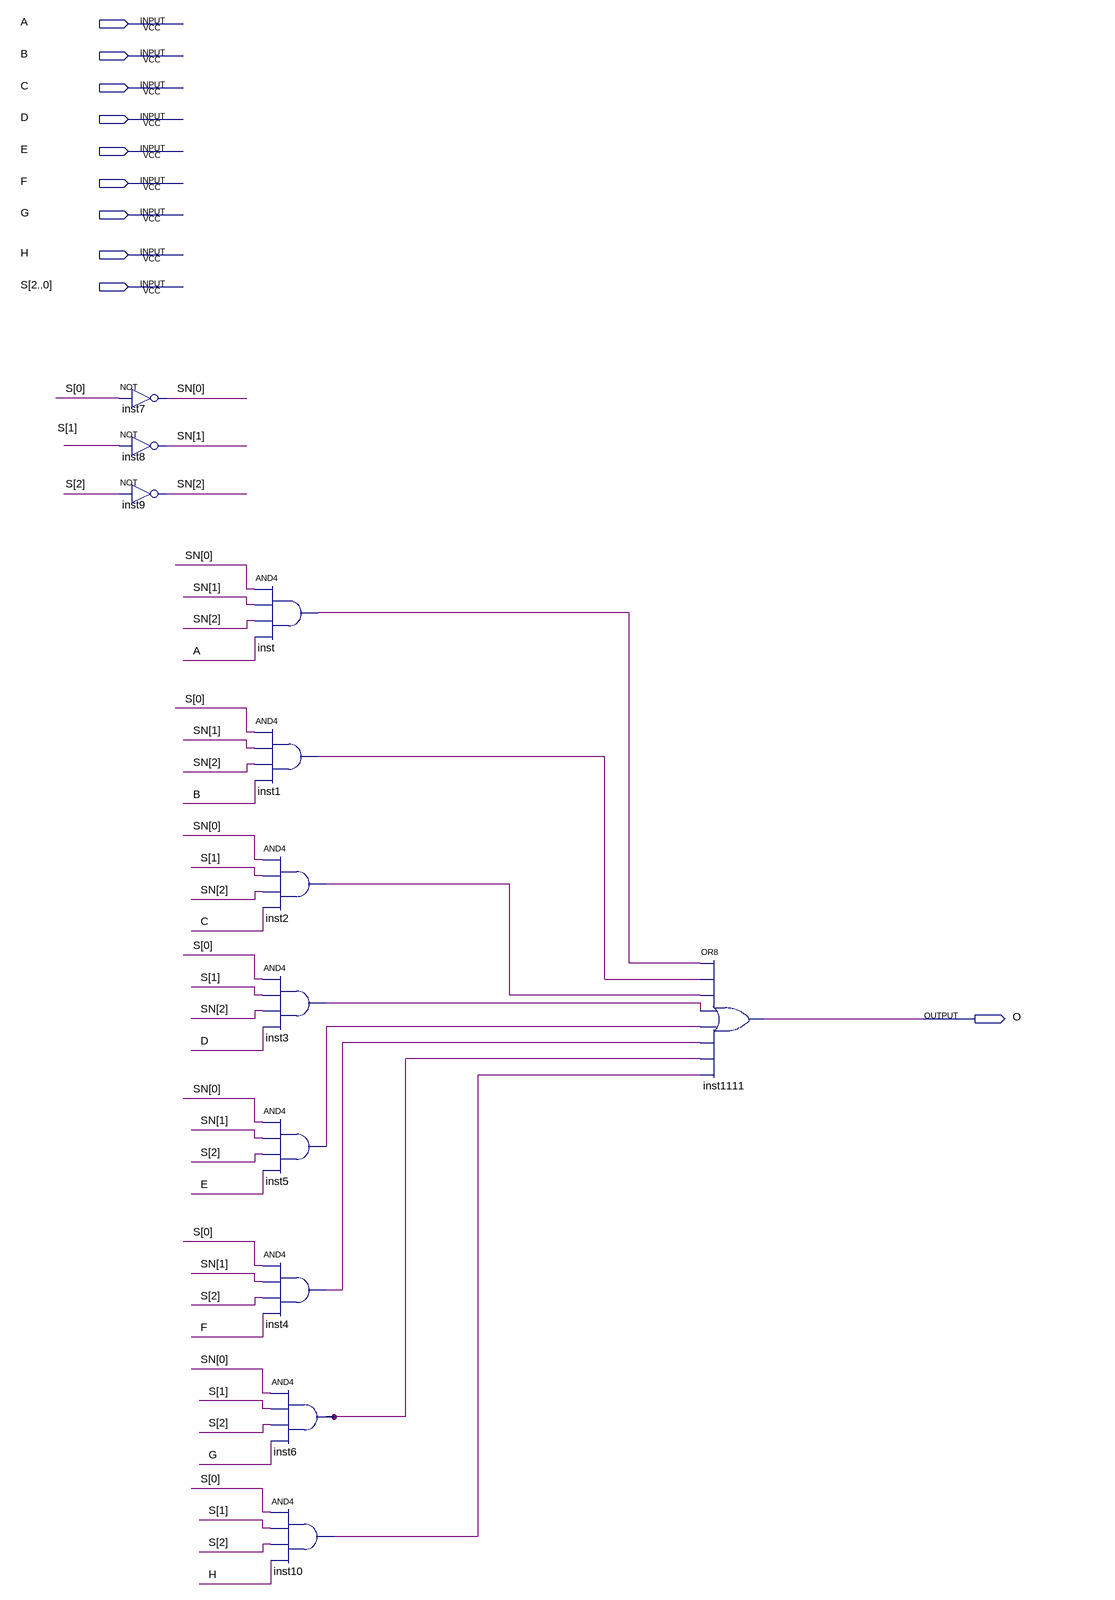
[diagram p0: schematic sheet]
// Quartus schematic 8_to_1_MUX.bdf as structural Verilog: 12 symbols, 10 pins
module \8_to_1_MUX  (
  input  A,
  input  B,
  input  C,
  input  D,
  input  E,
  input  F,
  input  G,
  input  H,
  input  [2:0] S,
  output O
);

  wire inst1_out, inst2_out, inst3_out, inst4_out, inst5_out, inst6_out, inst10_out, inst_out;
  wire [2:0] SN;

  not inst7 (SN[0], S[0]);
  not inst8 (SN[1], S[1]);
  not inst9 (SN[2], S[2]);
  and inst (inst_out, SN[0], SN[1], SN[2], A);
  and inst1 (inst1_out, S[0], SN[1], SN[2], B);
  and inst2 (inst2_out, SN[0], S[1], SN[2], C);
  and inst3 (inst3_out, S[0], S[1], SN[2], D);
  and inst5 (inst5_out, SN[0], SN[1], S[2], E);
  and inst4 (inst4_out, S[0], SN[1], S[2], F);
  and inst6 (inst6_out, SN[0], S[1], S[2], G);
  and inst10 (inst10_out, S[0], S[1], S[2], H);
  or inst1111 (O, inst_out, inst1_out, inst2_out, inst3_out, inst5_out, inst4_out, inst6_out, inst10_out);
endmodule
